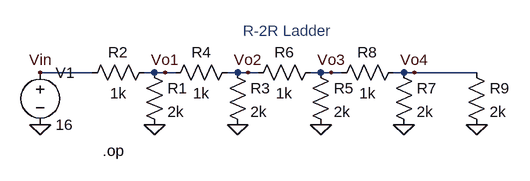
[diagram p0: schematic R-2R Ladder.asc]
R-2R Ladder.asc, the LTspice schematic file:
Version 4
SHEET 1 880 680
WIRE 16 128 -64 128
WIRE 112 128 96 128
WIRE 128 128 112 128
WIRE 144 128 128 128
WIRE 240 128 224 128
WIRE 256 128 240 128
WIRE 272 128 256 128
WIRE 368 128 352 128
WIRE 384 128 368 128
WIRE 400 128 384 128
WIRE 496 128 480 128
WIRE 512 128 496 128
WIRE 608 128 512 128
FLAG -64 208 0
FLAG 112 208 0
FLAG 240 208 0
FLAG 368 208 0
FLAG 496 208 0
FLAG 608 208 0
FLAG -64 128 Vin
FLAG 128 128 Vo1
FLAG 256 128 Vo2
FLAG 384 128 Vo3
FLAG 512 128 Vo4
SYMBOL voltage -64 112 R0
WINDOW 123 0 0 Left 2
WINDOW 39 0 0 Left 2
SYMATTR InstName V1
SYMATTR Value 16
SYMBOL res 96 112 R0
SYMATTR InstName R1
SYMATTR Value 2k
SYMBOL res 112 112 R90
WINDOW 0 0 56 VBottom 2
WINDOW 3 32 56 VTop 2
SYMATTR InstName R2
SYMATTR Value 1k
SYMBOL res 224 112 R0
SYMATTR InstName R3
SYMATTR Value 2k
SYMBOL res 240 112 R90
WINDOW 0 0 56 VBottom 2
WINDOW 3 32 56 VTop 2
SYMATTR InstName R4
SYMATTR Value 1k
SYMBOL res 352 112 R0
SYMATTR InstName R5
SYMATTR Value 2k
SYMBOL res 368 112 R90
WINDOW 0 0 56 VBottom 2
WINDOW 3 32 56 VTop 2
SYMATTR InstName R6
SYMATTR Value 1k
SYMBOL res 480 112 R0
SYMATTR InstName R7
SYMATTR Value 2k
SYMBOL res 496 112 R90
WINDOW 0 0 56 VBottom 2
WINDOW 3 32 56 VTop 2
SYMATTR InstName R8
SYMATTR Value 1k
SYMBOL res 592 112 R0
SYMATTR InstName R9
SYMATTR Value 2k
TEXT 32 248 Left 2 !.op
TEXT 248 64 Left 2 ;R-2R Ladder

The netlist it stands for:
* R-2R Ladder.asc
V1 Vin 0 16
R1 Vo1 0 2k
R2 Vo1 Vin 1k
R3 Vo2 0 2k
R4 Vo2 Vo1 1k
R5 Vo3 0 2k
R6 Vo3 Vo2 1k
R7 Vo4 0 2k
R8 Vo4 Vo3 1k
R9 Vo4 0 2k
.op
* R-2R Ladder
.backanno
.end